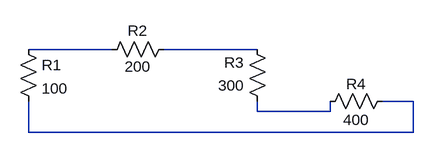
[diagram p0: schematic 01- Resistors and wires.asc]
01- Resistors and wires.asc, the LTspice schematic file:
Version 4.1
SHEET 1 880 680
WIRE 224 128 96 128
WIRE 448 128 304 128
WIRE 688 208 640 208
WIRE 448 224 448 208
WIRE 560 224 560 208
WIRE 560 224 448 224
WIRE 96 256 96 208
WIRE 688 256 688 208
WIRE 688 256 96 256
SYMBOL res 80 112 R0
SYMATTR InstName R1
SYMATTR Value 100
SYMBOL res 320 112 R90
WINDOW 0 3 56 VBottom 2
WINDOW 3 27 56 VTop 2
SYMATTR InstName R2
SYMATTR Value 200
SYMBOL res 464 224 R180
WINDOW 0 36 76 Left 2
WINDOW 3 36 40 Left 2
SYMATTR InstName R3
SYMATTR Value 300
SYMBOL res 544 224 R270
WINDOW 0 27 56 VTop 2
WINDOW 3 3 56 VBottom 2
SYMATTR InstName R4
SYMATTR Value 400

The netlist it stands for:
* 01- Resistors and wires.asc
R1 N001 N003 100
R2 N002 N001 200
R3 N004 N002 300
R4 N004 N003 400
.backanno
.end